# Altium schematic sheet pi-kvm_v1.1.SchDoc
size A1
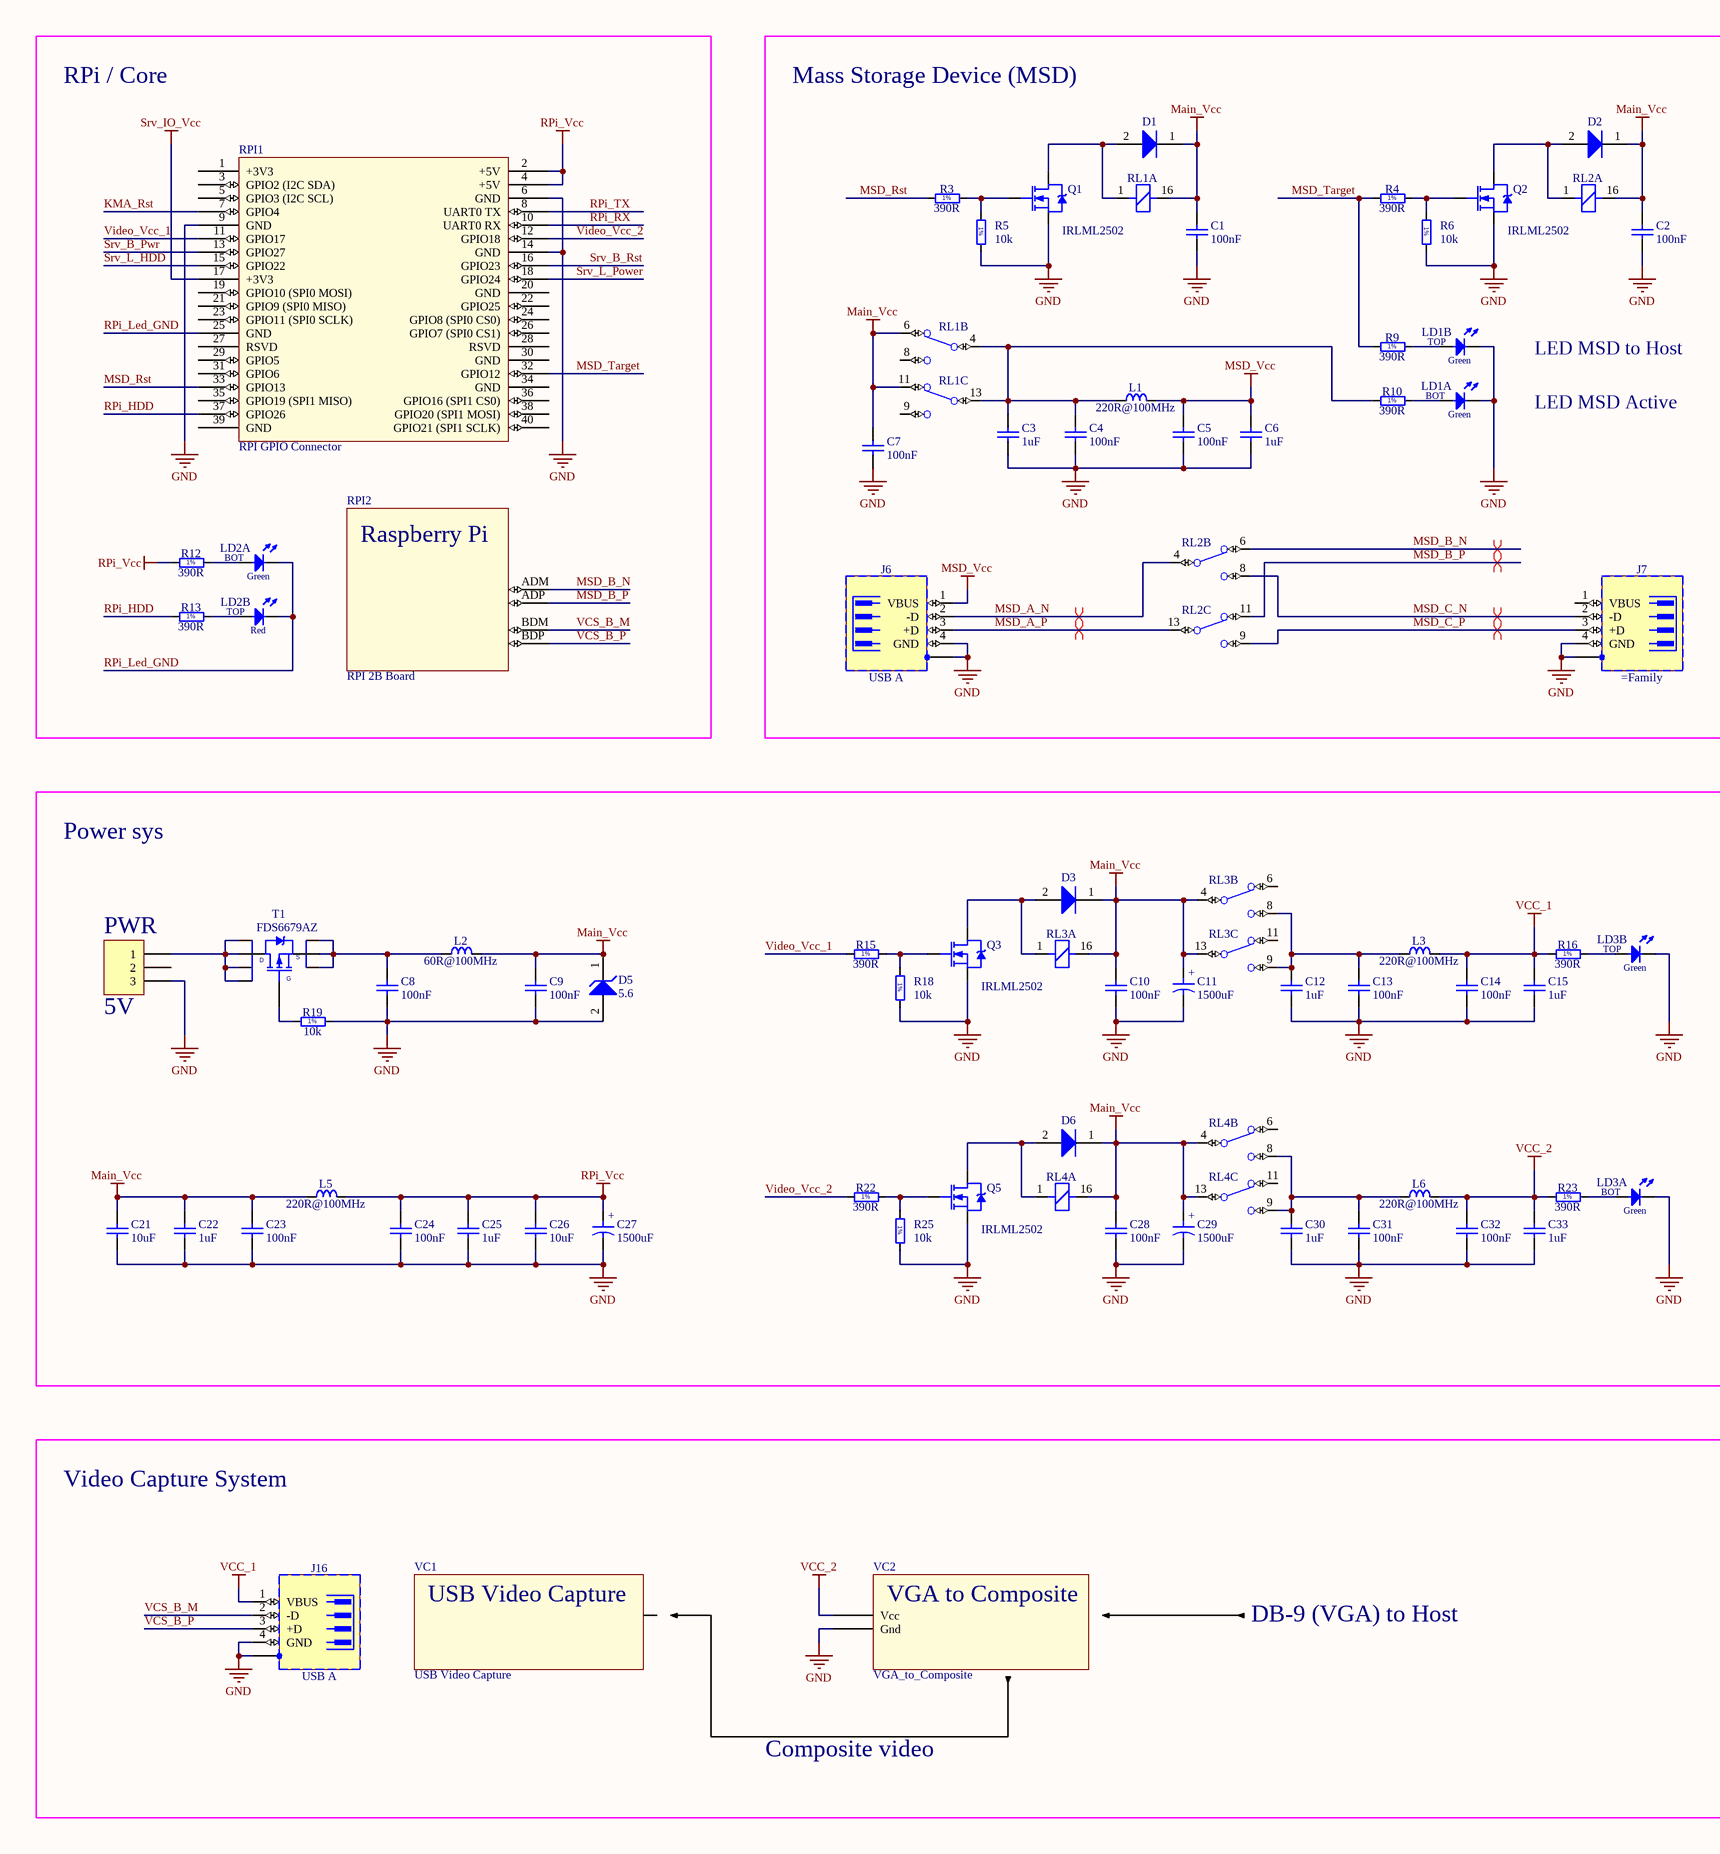
[diagram p0: pi-kvm_v1.1.SchDoc, left]
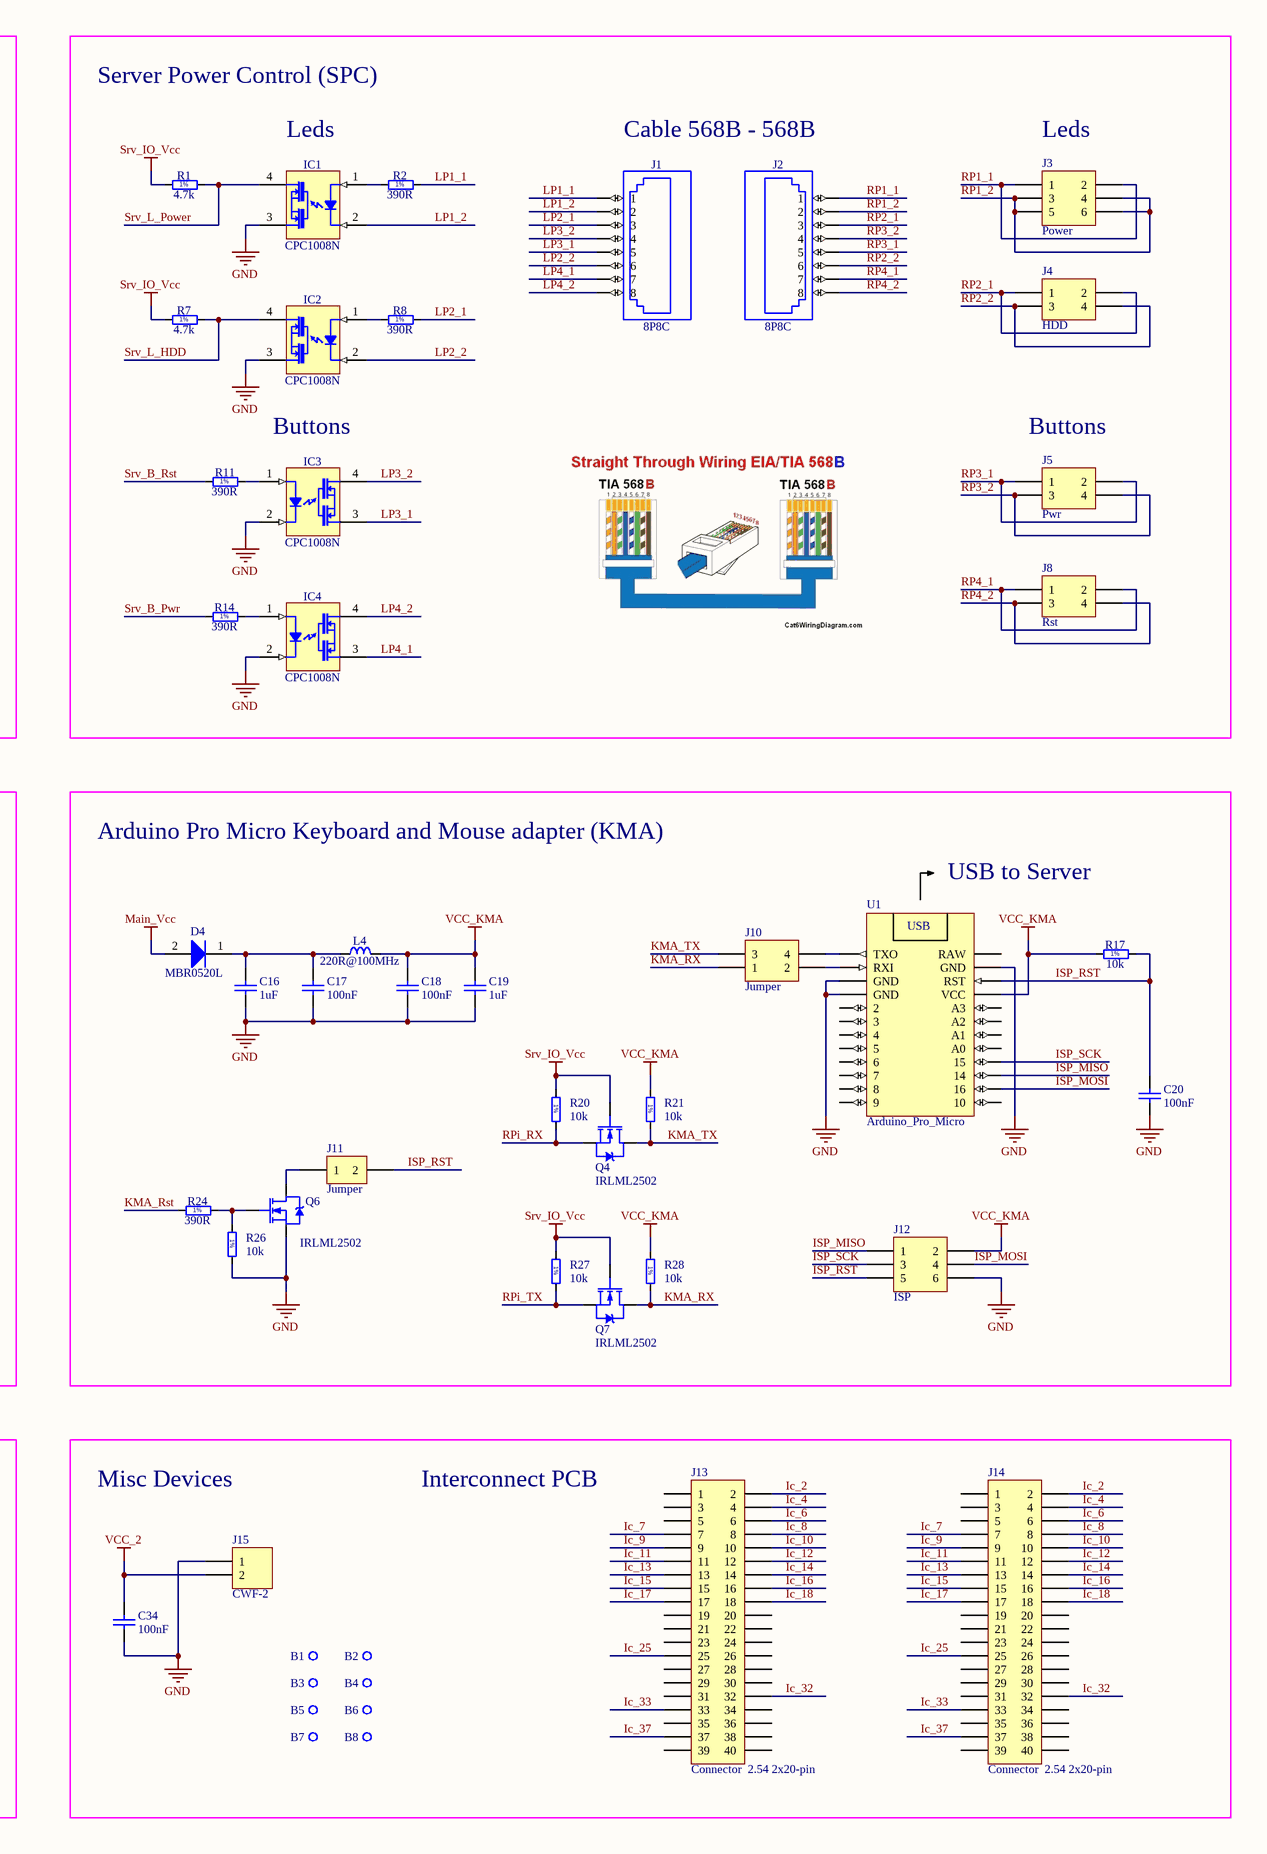
[diagram p1: pi-kvm_v1.1.SchDoc, right]

## Parts
B1  (no value)  [MTG300_600_vias]
B2  (no value)  [MTG300_600_vias]
B3  (no value)  [MTG300_600_vias]
B4  (no value)  [MTG300_600_vias]
B5  (no value)  [MTG300_600_vias]
B6  (no value)  [MTG300_600_vias]
B7  (no value)  [MTG300_600_vias]
B8  (no value)  [MTG300_600_vias]
C1  100nF  [CAPC2012X135N]
C2  100nF  [CAPC2012X135N]
C3  1uF  [CAPC2012X135N]
C4  100nF  [CAPC2012X135N]
C5  100nF  [CAPC2012X135N]
C6  1uF  [CAPC2012X135N]
C7  100nF  [CAPC2012X135N]
C8  100nF  [CAPC2012X135N]
C9  100nF  [CAPC2012X135N]
C10  100nF  [CAPC2012X135N]
C11  1500uF  [CAPPR500-1050X1300]
C12  1uF  [CAPC2012X135N]
C13  100nF  [CAPC2012X135N]
C14  100nF  [CAPC2012X135N]
C15  1uF  [CAPC2012X135N]
C16  1uF  [CAPC2012X135N]
C17  100nF  [CAPC2012X135N]
C18  100nF  [CAPC2012X135N]
C19  1uF  [CAPC2012X135N]
C20  100nF  [CAPC2012X135N]
C21  10uF  [CAPC2012X135N]
C22  1uF  [CAPC2012X135N]
C23  100nF  [CAPC2012X135N]
C24  100nF  [CAPC2012X135N]
C25  1uF  [CAPC2012X135N]
C26  10uF  [CAPC2012X135N]
C27  1500uF  [CAPPR500-1050X1300]
C28  100nF  [CAPC2012X135N]
C29  1500uF  [CAPPR500-1050X1300]
C30  1uF  [CAPC2012X135N]
C31  100nF  [CAPC2012X135N]
C32  100nF  [CAPC2012X135N]
C33  1uF  [CAPC2012X135N]
C34  100nF  [CAPC2012X135N]
D1  1N4148W  [SOD3816X118N]  (value not drawn)
D2  1N4148W  [SOD3816X118N]  (value not drawn)
D3  1N4148W  [SOD3816X118N]  (value not drawn)
D4  MBR0520L  [SOD3816X118N]
D5  5.6  [DIOM5027X244N]
D6  1N4148W  [SOD3816X118N]  (value not drawn)
IC1  CPC1008N  [SOIC254P610X218-4N]
IC2  CPC1008N  [SOIC254P610X218-4N]
IC3  CPC1008N  [SOIC254P610X218-4N]
IC4  CPC1008N  [SOIC254P610X218-4N]
J1  8P8C  [FCI_54602-908LF]
J2  8P8C  [FCI_54602-908LF]
J3  Power  [SAMTEC_MTLW-103-07-L-D-250]
J4  HDD  [SAMTEC_MTLW-102-07-L-D-250]
J5  Pwr  [SAMTEC_MTLW-102-07-L-D-250]
J6  USB A  [FCI_87520-0010BLF]
J7  (no value)  [TYCO_292304-1]
J8  Rst  [SAMTEC_MTLW-102-07-L-D-250]
J9  Connector  5.08 3-pin  [PHOENIX_1755749]  (value not drawn)
J10  Jumper  [SAMTEC_MTLW-102-07-L-D-250]
J11  Jumper  [COMATEL_385.0358.1.02.400]
J12  ISP  [SAMTEC_MTLW-103-07-L-D-250]
J13  Connector  2.54 2x20-pin  [FCI_87606-320LF]
J14  Connector  2.54 2x20-pin  [FCI_87606-320LF]
J15  CWF-2  [CWF-2]
J16  USB A  [FCI_87520-0010BLF]
L1  220R@100MHz  [INDC2012X105N]
L2  60R@100MHz  [INDC4516X180N]
L3  220R@100MHz  [INDC2012X105N]
L4  220R@100MHz  [INDC2012X105N]
L5  220R@100MHz  [INDC2012X105N]
L6  220R@100MHz  [INDC2012X105N]
LD1  (no value)  [LED_DIALIGHT_553-0122-200F]  (parts A,B of 2)
LD2  (no value)  [LED_DIALIGHT_553-0112-200F]  (parts A,B of 2)
LD3  (no value)  [LED_DIALIGHT_553-0122-200F]  (parts A,B of 2)
Q1  IRLML2502  [SOT23]
Q2  IRLML2502  [SOT23]
Q3  IRLML2502  [SOT23]
Q4  IRLML2502  [SOT23]
Q5  IRLML2502  [SOT23]
Q6  IRLML2502  [SOT23]
Q7  IRLML2502  [SOT23]
R1  4.7k  [RESC2012X60N]
R2  390R  [RESC2012X60N]
R3  390R  [RESC2012X60N]
R4  390R  [RESC2012X60N]
R5  10k  [RESC2012X60N]
R6  10k  [RESC2012X60N]
R7  4.7k  [RESC2012X60N]
R8  390R  [RESC2012X60N]
R9  390R  [RESC2012X60N]
R10  390R  [RESC2012X60N]
R11  390R  [RESC2012X60N]
R12  390R  [RESC2012X60N]
R13  390R  [RESC2012X60N]
R14  390R  [RESC2012X60N]
R15  390R  [RESC2012X60N]
R16  390R  [RESC2012X60N]
R17  10k  [RESC2012X60N]
R18  10k  [RESC2012X60N]
R19  10k  [RESC2012X60N]
R20  10k  [RESC2012X60N]
R21  10k  [RESC2012X60N]
R22  390R  [RESC2012X60N]
R23  390R  [RESC2012X60N]
R24  390R  [RESC2012X60N]
R25  10k  [RESC2012X60N]
R26  10k  [RESC2012X60N]
R27  10k  [RESC2012X60N]
R28  10k  [RESC2012X60N]
RL1  (no value)  [REL_HK19F_DC5V]  (parts A,B,C of 3)
RL2  (no value)  [REL_HK19F_DC5V]  (parts A,B,C of 3)
RL3  (no value)  [REL_HK19F_DC5V]  (parts A,B,C of 3)
RL4  (no value)  [REL_HK19F_DC5V]  (parts A,B,C of 3)
RPI1  RPI GPIO Connector  [3M_N2540-6002RB]
RPI2  RPI 2B Board  [RPi 2B Board]
T1  FDS6679AZ  [SOIC127P600X175-8N]
U1  Arduino_Pro_Micro  [Arduino_Pro_Micro]
VC1  USB Video Capture  [USB_Video_Capture]
VC2  VGA_to_Composite  [VGA_to_Composite]

## Blocks framed on the sheet
RPi / Core: LD2 R12 R13 RPI1 RPI2
Mass Storage Device (MSD): C1-C7 D1 D2 J6 J7 L1 LD1 Q1 Q2 R3-R6 R9 R10 RL1 RL2

## Nets
GND: C1.2 C2.2 C3.2 C4.2 C5.2 C6.2 C7.2 C8.2 C9.2 C10.2 C11.2 C12.2 C13.2 C14.2 C15.2 C16.2 C17.2 C18.2 C19.2 C20.2 C21.2 C22.2 C23.2 C24.2 C25.2 C26.2 C27.2 C28.2 C29.2 C30.2 C31.2 C32.2 C33.2 C34.2 D5.2(A) IC1.3(C) IC2.3(C) IC3.2(K) IC4.2(K) J6.4(GND) J6.5(SHIELD) J7.4(GND) J7.5(SHIELD) J9.3 J12.6 J15.1 J16.4(GND) J16.5(SHIELD) LD1.1(C) LD1.3(C) LD3.1(C) LD3.3(C) Q1.2(S) Q2.2(S) Q3.2(S) Q5.2(S) Q6.2(S) R5.2 R6.2 R18.2 R19.2 R25.2 R26.2 RPI1.6(GND) RPI1.9(GND) RPI1.14(GND) U1.3(GND) U1.4(GND) U1.23(GND) VC2.2(Gnd)
Main_Vcc: C1.1 C2.1 C7.1 C9.1 C10.1 C11.1 C21.1 C22.1 C23.1 C28.1 C29.1 D1.1(K) D2.1(K) D3.1(K) D4.2(A) D5.1(K) D6.1(K) L2.2 L5.1 RL1.6(NC) RL1.11(NC) RL1.16 RL2.16 RL3.4(C) RL3.13(C) RL3.16 RL4.4(C) RL4.13(C) RL4.16
MSD_Vcc: C5.1 C6.1 J6.1(VBUS) L1.2
RPi_Vcc: C24.1 C25.1 C26.1 C27.1 L5.2 R12.1 RPI1.2(+5V) RPI1.4(+5V)
Srv_IO_Vcc: Q4.1(G) Q7.1(G) R1.1 R7.1 R20.1 R27.1 RPI1.17(+3V3)
VCC_1: C14.1 C15.1 J16.1(VBUS) L3.2 R16.1
VCC_2: C32.1 C33.1 C34.1 J15.2 L6.2 R23.1 VC2.1(Vcc)
VCC_KMA: C18.1 C19.1 J12.2 L4.2 R17.1 R21.1 R28.1 U1.21(VCC)
Ic_2: J13.2 J14.2
Ic_4: J13.4 J14.4
Ic_6: J13.6 J14.6
Ic_7: J13.7 J14.7
Ic_8: J13.8 J14.8
Ic_9: J13.9 J14.9
Ic_10: J13.10 J14.10
Ic_11: J13.11 J14.11
Ic_12: J13.12 J14.12
Ic_13: J13.13 J14.13
Ic_14: J13.14 J14.14
Ic_15: J13.15 J14.15
Ic_16: J13.16 J14.16
Ic_17: J13.17 J14.17
Ic_18: J13.18 J14.18
Ic_25: J13.25 J14.25
Ic_32: J13.32 J14.32
Ic_33: J13.33 J14.33
Ic_37: J13.37 J14.37
ISP_MISO: J12.1 U1.15(14)
ISP_MOSI: J12.4 U1.14(16)
ISP_RST: C20.1 J11.2 J12.5 R17.2 U1.22(RST)
ISP_SCK: J12.3 U1.16(15)
KMA_Rst: R24.1 RPI1.7(GPIO4)
KMA_RX: J10.1 Q7.3(D) R28.2
KMA_TX: J10.3 Q4.3(D) R21.2
LP1_1: J1.1 R2.1
LP1_2: IC1.2(K) J1.2
LP2_1: J1.3 R8.1
LP2_2: IC2.2(K) J1.6
LP3_1: IC3.3(C) J1.5
LP3_2: IC3.4(E) J1.4
LP4_1: IC4.3(C) J1.7
LP4_2: IC4.4(E) J1.8
MSD_A_N: J6.2(-D) RL2.4(C)
MSD_A_P: J6.3(+D) RL2.13(C)
MSD_B_N: RL2.6(NC) RPI2.ADM
MSD_B_P: RL2.11(NC) RPI2.ADP
MSD_C_N: J7.2(-D) RL2.8(NO)
MSD_C_P: J7.3(+D) RL2.9(NO)
MSD_Rst: R3.1 RPI1.33(GPIO13)
MSD_Target: R4.1 R9.1 RPI1.32(GPIO12)
RP1_1: J2.1 J3.1 J3.2
RP1_2: J2.2 J3.3 J3.4 J3.5 J3.6
RP2_1: J2.3 J4.1 J4.2
RP2_2: J2.6 J4.3 J4.4
RP3_1: J2.5 J5.1 J5.2
RP3_2: J2.4 J5.3 J5.4
RP4_1: J2.7 J8.1 J8.2
RP4_2: J2.8 J8.3 J8.4
RPi_HDD: R13.1 RPI1.37(GPIO26)
RPi_Led_GND: LD2.1(C) LD2.3(C) RPI1.25(GND)
RPi_RX: Q4.2(S) R20.2 RPI1.10(UART0_RX)
RPi_TX: Q7.2(S) R27.2 RPI1.8(UART0_TX)
Srv_B_Pwr: R14.1 RPI1.13(GPIO27)
Srv_B_Rst: R11.1 RPI1.16(GPIO23)
Srv_L_HDD: IC2.4(E) R7.2 RPI1.15(GPIO22)
Srv_L_Power: IC1.4(E) R1.2 RPI1.18(GPIO24)
VCS_B_M: J16.2(-D) RPI2.BDM
VCS_B_P: J16.3(+D) RPI2.BDP
Video_Vcc_1: R15.1 RPI1.11(GPIO17)
Video_Vcc_2: R22.1 RPI1.12(GPIO18)
NetC3_1: C3.1 C4.1 L1.1 R10.1 RL1.4(C) RL1.13(C)
NetC8_1: C8.1 L2.1 T1.1(S) T1.2(S) T1.3(S)
NetC12_1: C12.1 C13.1 L3.1 RL3.8(NO) RL3.9(NO)
NetC16_1: C16.1 C17.1 D4.1(K) L4.1
NetC30_1: C30.1 C31.1 L6.1 RL4.8(NO) RL4.9(NO)
NetD1_2: D1.2(A) Q1.3(D) RL1.1
NetD2_2: D2.2(A) Q2.3(D) RL2.1
NetD3_2: D3.2(A) Q3.3(D) RL3.1
NetD6_2: D6.2(A) Q5.3(D) RL4.1
NetIC1_1: IC1.1(A) R2.2
NetIC2_1: IC2.1(A) R8.2
NetIC3_1: IC3.1(A) R11.2
NetIC4_1: IC4.1(A) R14.2
NetJ9_1: J9.1 T1.5(D) T1.6(D) T1.7(D) T1.8(D)
NetJ10_2: J10.2 U1.2(RXI)
NetJ10_4: J10.4 U1.1(TXO)
NetJ11_1: J11.1 Q6.3(D)
NetLD1_2: LD1.2(A) R10.2
NetLD1_4: LD1.4(A) R9.2
NetLD2_2: LD2.2(A) R12.2
NetLD2_4: LD2.4(A) R13.2
NetLD3_2: LD3.2(A) R23.2
NetLD3_4: LD3.4(A) R16.2
NetQ1_1: Q1.1(G) R3.2 R5.1
NetQ2_1: Q2.1(G) R4.2 R6.1
NetQ3_1: Q3.1(G) R15.2 R18.1
NetQ5_1: Q5.1(G) R22.2 R25.1
NetQ6_1: Q6.1(G) R24.2 R26.1
NetR19_1: R19.1 T1.4(G)

Not connected (* = marked no-connect by the designer): B1 1; B2 1; B3 1; B4 1; B5 1; B6 1; B7 1; B8 1; J7 1(VBUS); J9 2; J13 1 3 5 19 20 21 22 23 24 26 27 28 29 30 31 34 35 36 38 39 40; J14 1 3 5 19 20 21 22 23 24 26 27 28 29 30 31 34 35 36 38 39 40; RL1 8(NO) 9(NO); RL3 6(NC) 11(NC); RL4 6(NC) 11(NC); RPI1 1(+3V3) 3(GPIO2_(I2C_SDA)) 5(GPIO3_(I2C_SCL)) 19(GPIO10_(SPI0_MOSI)) 20(GND) 21(GPIO9_(SPI0_MISO)) 22(GPIO25) 23(GPIO11_(SPI0_SCLK)) 24(GPIO8_(SPI0_CS0)) 26(GPIO7_(SPI0_CS1)) 27(RSVD) 28(RSVD) 29(GPIO5) 30(GND) 31(GPIO6) 34(GND) 35(GPIO19_(SPI1_MISO)) 36(GPIO16_(SPI1_CS0)) 38(GPIO20_(SPI1_MOSI)) 39(GND) 40(GPIO21_(SPI1_SCLK)); U1 5(2) 6(3) 7(4) 8(5) 9(6) 10(7) 11(8) 12(9) 13(10) 17(A0) 18(A1) 19(A2) 20(A3) 24(RAW); VC1 0

## Layout directives
differential pair: MSD_A_N, MSD_A_P, MSD_B_N, MSD_B_P, MSD_C_N, MSD_C_P

## Notes on the sheet
- Server Power Control (SPC)
- (near IC1) Leds
- Cable 568B - 568B
- (near J3) Leds
- LED MSD to Host
- LED MSD Active
- Buttons
- (near J5) Buttons
- Power sys
- Arduino Pro Micro Keyboard and Mouse adapter (KMA)
- (near J9) PWR
- USB to Server
- (near J9) 5V
- Video Capture System
- Misc Devices
- Interconnect PCB
- DB-9 (VGA) to Host
- Composite video
- (in symbol Arduino_Pro_Micro) USB
- (in symbol Cap 1500uF x 6.3V) +
- (in symbol LED x2 G-1C2A-BOT_R-3C4A-TOP, part A) BOT; Green
- (in symbol LED x2 G-1C2A-BOT_R-3C4A-TOP, part B) TOP; Red
- (in symbol LED x2 Green 1C2A-BOT_3C4A-TOP, part A) BOT; Green
- (in symbol LED x2 Green 1C2A-BOT_3C4A-TOP, part B) TOP; Green
- (in symbol RPI 2B Board) Raspberry Pi
- (in symbol VGA_to_Composite) VGA to Composite

## Library data of the parts
B1-B8 = PLATED_HOLE3.0_PAD6.0: Part Description: Plated Through Hole: Hole Dia.=3.0mm Pad Dia.=6.0mm; Manufacturer: GENERIC; Type: Standard (No BOM); Footprint: MTG300_600; Pin Count: 1; ComponentHeight: 0mm; Manufacturer Part Number: PLATED_HOLE3.0_PAD6.0
C1 C2 C4 C5 C7-C10 C13 C14 C17 C18 C20 C23 C24 C28 C31 C32 C34 = C_0805_100nF_50V_10%_X7R: Manufacturer: Yageo(YAG); Manufacturer Part Number: CC0805KPX7R9BB104; Voltage: 50V; Tolerance: 10%; Dielectric: X7R; Component Kind: Standard; Pin Count: 2; Value: 100nF; Part Description: Capacitor 0805; Case: 0805
C3 C6 C12 C15 C16 C19 C22 C25 C30 C33 = C_0805_1uF_16V_10%_X7R: Manufacturer: Murata Electronics Inc. (MUR); Manufacturer Part Number: GRM21BR71C105KA01L; Voltage: 16V; Tolerance: 10%; Dielectric: X7R; Component Kind: Standard; Pin Count: 2; Value: 1uF; Part Description: Capacitor 0805; Case: 0805
C11 C27 C29 = Cap 1500uF x 6.3V: Manufacturer: United Chemi-Con; Manufacturer Part Number: EKZH6R3ELL152MH20D; Tolerance: ±20%; Component Kind: Standard; Pin Count: 2; Value: 1500uF; Voltage: 6.3V; Case: LS5 D10.5 x H13; ComponentHeight: 13mm
C21 C26 = C_0805_10uF_10V_10%_X7R: Manufacturer: Murata Electronics Inc. (MUR); Manufacturer Part Number: GRM21BR71A106KE51L; Voltage: 10V; Tolerance: 10%; Dielectric: X7R; Component Kind: Standard; Pin Count: 2; Value: 10uF; Part Description: Capacitor 0805; Case: 0805
D1-D3 D6 = 1N4148W: Manufacturer: On Semiconductor(ONS); Manufacturer Part Number: 1N4148W; Pin Count: 2
D4 = MBR0520L: Manufacturer: On Semiconductor(ONS); Manufacturer Part Number: MBR0520L; Pin Count: 2
D5 = 1SMA5919BT3G: 1.5 W Zener Voltage Regulator, 2-Pin SMA, Pb-Free, Tape and Reel; Manufacturer: On Semiconductor; Part Description: 2-Pin Small Molded Package, J-Bend Lead, Body 2.605 x 4.315 mm; PackageReference: SMA-2-403D-02_F; Manufacturer Part Number: 1SMA5919BT3G; Pin Count: 2; Value: 5.6
IC1-IC4 = PhotoMOS Relay x1 Type2: PhotoMOS Relay; Part Description: 100V Blocking Voltage, 150mA Load Current, Ron 8 Ohm, 1-Form-A (normally open) Single Channel  OptoMOS Relay; Manufacturer: Ixys Corporation (IXYS); Component Kind: Standard; Manufacturer Part Number: CPC1008N; Pin Count: 4; Case: SOIC4; ComponentHeight: 2.184mm
J1 J2 = FCI_54602-908LF: 1 Port, 8 Positions, CAT3 RJ45 Horizontal Modular Jack; Manufacturer: Fci Electronics(FCI); Pin Count: 8; Manufacturer Part Number: 54602-908LF
J3 J12 = Connector  2.54 3x2-pin: Manufacturer: CONNFLY ELECTRONIC CO.,LTD.(CONNFLY); Manufacturer Part Number: PLD-6; Pin Count: 6
J4 J5 J8 J10 = Connector  2.54 2x2-pin: Manufacturer: CONNFLY ELECTRONIC CO.,LTD.(CONNFLY); Manufacturer Part Number: PLD-8; Pin Count: 4
J6 J16 = Connector USB A - 4 Pin + 1Shield: 4 Pin + 1 Shield USB Receptacle; Part Description: USB 2.0 Type A Receptacle, 4 Pins, Right Angle, Shielded; Manufacturer: Te Connectivity(TE); Manufacturer Part Number: 292303-1; Component Kind: Standard; Pin Count: 6; ComponentHeight: 7.7mm
J7 = Connector USB B - 4 Pin + 1Shield: 4 Pin + 1 Shield USB Receptacle; Part Description: Thru Hole, Right Angle, 4 Position, Type B, USB Receptacle; Manufacturer: Te Connectivity(TE); Manufacturer Part Number: 292304-1; Component Kind: Standard; Pin Count: 5; ComponentHeight: 11.5mm
J11 = Connector  2.54 2-pin opposite: Connector  2.54 2-pin; Manufacturer Part Number: PLS-2; Manufacturer: CONNFLY ELECTRONIC CO.,LTD.(CONNFLY); Pin Count: 2
J13 J14 = Connector  2.54 2x20-pin: Manufacturer: CONNFLY ELECTRONIC CO.,LTD.(CONNFLY); Manufacturer Part Number: PBD-40; Pin Count: 40
J15 = CWF-2: Manufacturer Part Number: DS1069-2 M (CWF-2); Manufacturer: CONNFLY ELECTRONIC CO.,LTD.(CONNFLY); Pin Count: 2
L1 L3-L6 = BLM21PG221SN1D: Part Description: SMD EMIFIL Suppression Chip Ferrite Bead; Manufacturer: Murata Electronics Inc. (MUR); Tolerance: ±25%; Component Kind: Standard; Pin Count: 2; Value: 220R@100MHz; Manufacturer Part Number: BLM21PG221SN1D; Case: 0805; ComponentHeight: 1.05mm
L2 = BLM41PG600SN1L: Part Description: SMD EMI Suppression Chip Ferrite Bead (BLM41P Serie); Manufacturer: Murata Electronics Inc. (MUR); Component Kind: Standard; Pin Count: 2; Value: 60R@100MHz; Manufacturer Part Number: BLM41PG600SN1L; Case: 1806; ComponentHeight: 1.8mm
LD1 LD3 = LED x2 Green 1C2A-BOT_3C4A-TOP: Part Description: Dual 3mm Green LED, Body 10.55x4.32mm, Pin spacing 2.54mm; Manufacturer: Dialight Corp.(DIALIGHT); Manufacturer Part Number: 553-0122-200F; Component Kind: Standard; Pin Count: 4; ComponentHeight: 9.65mm
LD2 = LED x2 G-1C2A-BOT_R-3C4A-TOP: 2x LED  Botom Green, Top Red; Part Description: Dual 3mm LED  (Top: Red, Bot: Green), Body 10.55x4.32mm, Pin spacing 2.54mm; Manufacturer: Dialight Corp.(DIALIGHT); Manufacturer Part Number: 553-0112-200F; Component Kind: Standard; Pin Count: 4; ComponentHeight: 9.65mm
Q1-Q7 = IRLML2502: N-ch 20V 4.2A 45mOhm; Manufacturer: Infineon Technologies Ag (Siemens Semiconductors) (INFIN); Manufacturer Part Number: IRLML2502GTRPBF; Part Description: 3-Pin SOT-23 Package 0.95 mm Pitch, 2.3 mm Lead Span; PackageReference: SOT-23; Pin Count: 3
R1 R7 = R_0805_4.7k_150V_125mW_1%: Manufacturer: Yageo(YAG); Manufacturer Part Number: RC0805FR-074K7L; Power: 125mW; Tolerance: 1%; Voltage: 150V; Component Kind: Standard; Pin Count: 2; Value: 4.7k; Part Description: Resistor 0805; Case: 0805
R2-R4 R8-R16 R22-R24 = R_0805_390R_150V_125mW_1%: Manufacturer: Yageo(YAG); Manufacturer Part Number: RC0805FR-07390RL; Power: 125mW; Tolerance: 1%; Voltage: 150V; Component Kind: Standard; Pin Count: 2; Value: 390R; Part Description: RESC2012X60N; Case: 0805
R5 R6 R17-R21 R25-R28 = R_0805_10k_150V_125mW_1%: Manufacturer: Yageo(YAG); Manufacturer Part Number: RC0805FR-0710KL; Power: 125mW; Tolerance: 1%; Voltage: 150V; Component Kind: Standard; Pin Count: 2; Value: 10k; Part Description: RESC2012X60N; Case: 0805
RL1-RL4 = REL_HK19F_DC5V: Miniature Relay for Signal Circuits; Part Description: DPDT High Sensitivity Miniature Relay for Signal Circuits, HK19F Serie; Manufacturer: HUI KE; Manufacturer Part Number: HK19F-DC5V-SHG; Voltage: 5VDC; Component Kind: Standard; Pin Count: 8; ComponentHeight: 11.5mm
RPI1 = RPI GPIO Connector: GPIO Header for Raspberry Pi A+/B+/Pi 2/Pi 3 - 2x20; Manufacturer: SparkFun Electronics; Manufacturer Part Number: PRT-14017; Pin Count: 40
RPI2 = RPI 2B Board: Manufacturer: GENERIC; Pin Count: 40
T1 = FDS6679AZ_Flip: -30V -13A P-Channel PowerTrench MOSFET; Manufacturer: On Semiconductor(ONS-FAIR); Component Kind: Standard; Part Description: -30V -13A P-Channel PowerTrench MOSFET; Manufacturer Part Number: FDS6679AZ; Pin Count: 8; Case: SOIC8; ComponentHeight: 1.75mm
VC1 = USB Video Capture: Manufacturer: GENERIC; Pin Count: 0
VC2 = VGA_to_Composite: Manufacturer: GENERIC; Pin Count: 2
J9 = Connector  5.08 3-pin: Pin Count: 3
U1 = Arduino_Pro_Micro: Pin Count: 24